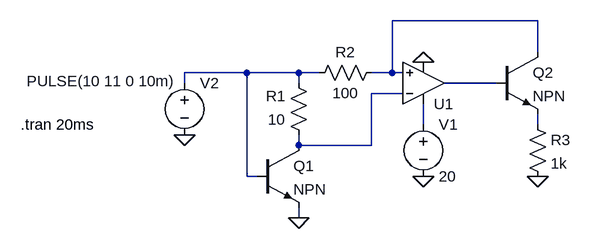
[diagram p0: schematic currentnotsensing.asc]
currentnotsensing.asc, the LTspice schematic file:
Version 4
SHEET 1 880 680
WIRE 384 64 160 64
WIRE 384 112 384 64
WIRE -64 144 -160 144
WIRE 16 144 -64 144
WIRE 48 144 16 144
WIRE 160 144 160 64
WIRE 160 144 128 144
WIRE 176 144 160 144
WIRE -160 160 -160 144
WIRE 16 160 16 144
WIRE 320 160 240 160
WIRE 176 176 128 176
WIRE 208 224 208 192
WIRE 384 224 384 208
WIRE 16 256 16 240
WIRE 128 256 128 176
WIRE 128 256 16 256
WIRE -64 304 -64 144
WIRE -48 304 -64 304
WIRE 16 368 16 352
FLAG 208 128 0
FLAG 208 304 0
FLAG 16 368 0
FLAG -160 240 0
FLAG 384 304 0
SYMBOL Opamps\\UniversalOpamp2 208 160 M180
SYMATTR InstName U1
SYMBOL voltage 208 208 R0
WINDOW 123 0 0 Left 2
WINDOW 39 0 0 Left 2
SYMATTR InstName V1
SYMATTR Value 20
SYMBOL voltage -160 144 R0
WINDOW 3 -243 13 Left 2
WINDOW 123 0 0 Left 2
WINDOW 39 0 0 Left 2
SYMATTR InstName V2
SYMATTR Value PULSE(10 11 0 10m)
SYMBOL res 32 256 R180
WINDOW 0 36 76 Left 2
WINDOW 3 36 40 Left 2
SYMATTR InstName R1
SYMATTR Value 10
SYMBOL npn -48 256 R0
SYMATTR InstName Q1
SYMBOL res 32 160 R270
WINDOW 0 32 56 VTop 2
WINDOW 3 0 56 VBottom 2
SYMATTR InstName R2
SYMATTR Value 100
SYMBOL npn 320 112 R0
SYMATTR InstName Q2
SYMBOL res 368 208 R0
SYMATTR InstName R3
SYMATTR Value 1k
TEXT -412 224 Left 2 !.tran 20ms

The netlist it stands for:
* currentnotsensing.asc
XU1 N001 N004 N005 0 N003 level.2 Avol=1Meg GBW=10Meg Slew=10Meg ilimit=25m rail=0 Vos=0 phimargin=45 en=0 enk=0 in=0 ink=0 Rin=500Meg  ; pins IN+ IN- V+ V- OUT
V1 N005 0 20
V2 N002 0 PULSE(10 11 0 10m)
R1 N004 N002 10
Q1 N004 N002 0 0 NPN
R2 N002 N001 100
Q2 N001 N003 N006 0 NPN
R3 N006 0 1k
.model NPN NPN
.model PNP PNP
.lib standard.bjt
.tran 20ms
.lib UniversalOpamps2.sub
.backanno
.end